# Altium schematic sheet SW7201.SchDoc
size 381 x 406 mm; SheetNumber: 1; SheetTotal: 1
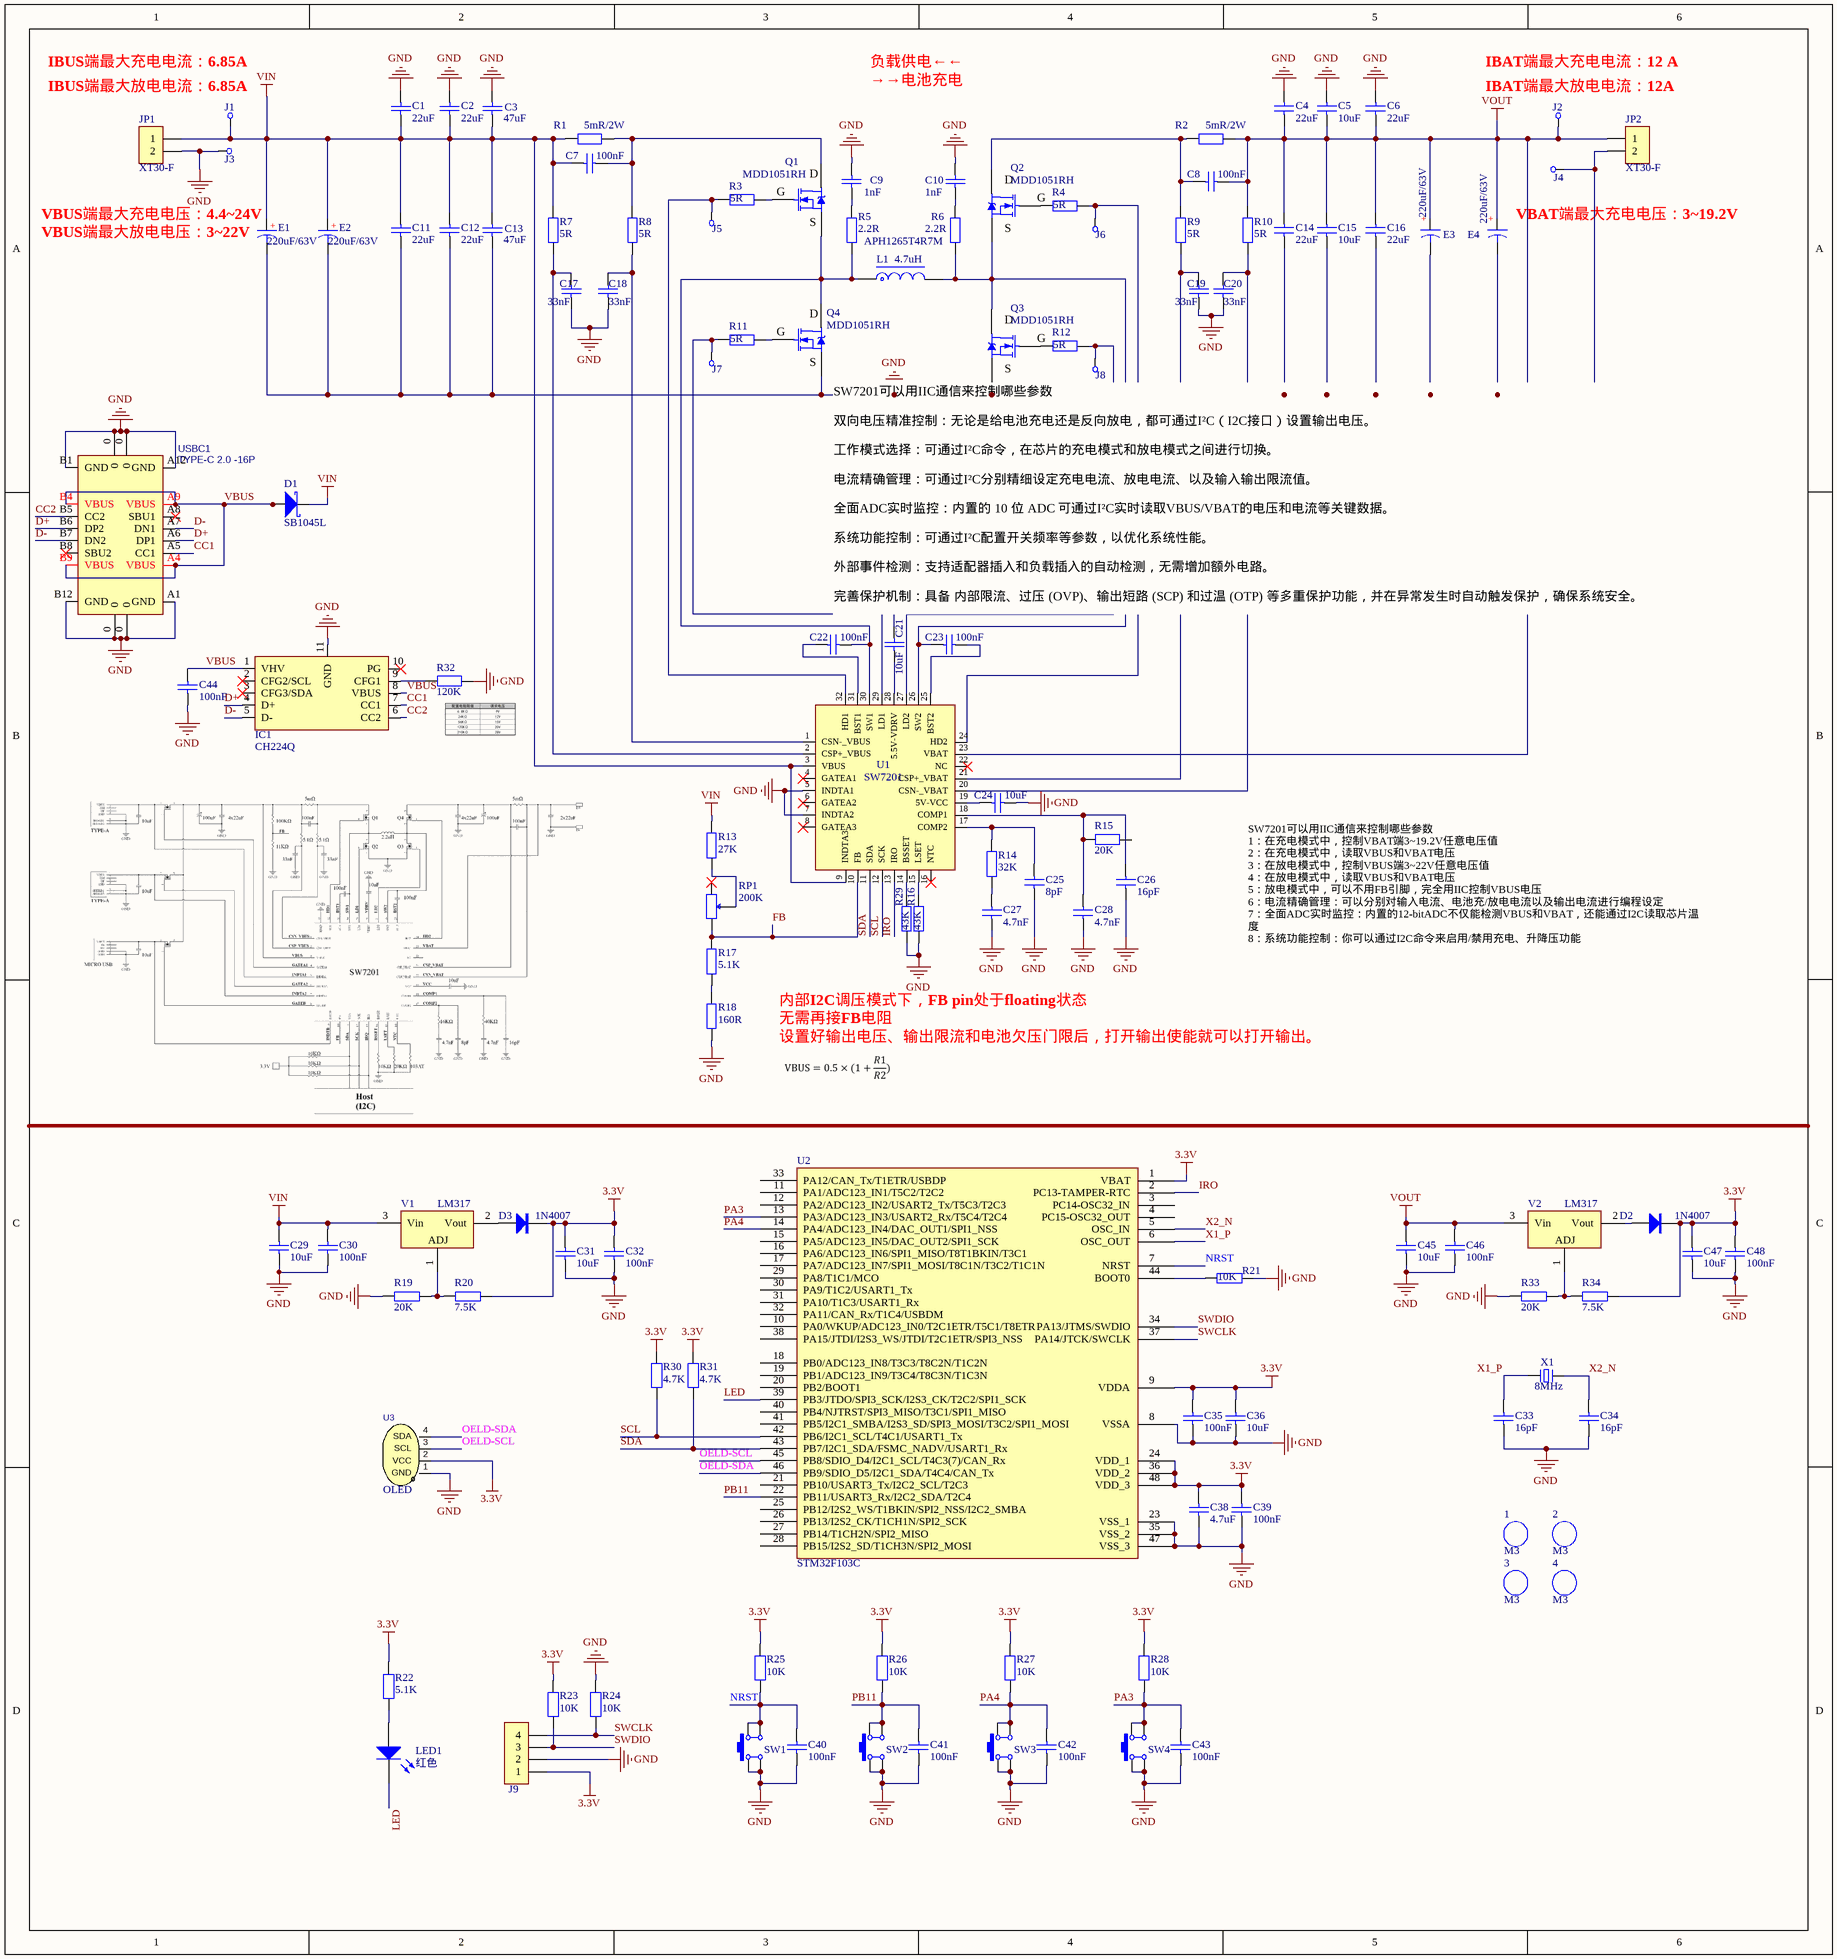
[diagram p0: SW7201.SchDoc]

## Parts
1  M3  [M3 125X200]
2  M3  [M3 125X200]
3  M3  [M3 125X200]
4  M3  [M3 125X200]
C1  22uF  [C0805_L]
C2  22uF  [C0805_L]
C3  47uF  [C0805_L]
C4  22uF  [C0805_L]
C5  10uF  [C0805_L]
C6  22uF  [C0805_L]
C7  100nF  [C0805_L]
C8  100nF  [C0805_L]
C9  1nF  [C0805_L]
C10  1nF  [C0805_L]
C11  22uF  [C0805_L]
C12  22uF  [C0805_L]
C13  47uF  [C0805_L]
C14  22uF  [C0805_L]
C15  10uF  [C0805_L]
C16  22uF  [C0805_L]
C17  33nF  [C0805_L]
C18  33nF  [C0805_L]
C19  33nF  [C0805_L]
C20  33nF  [C0805_L]
C21  10uF  [C0805_L]
C22  100nF  [C0805_L]
C23  100nF  [C0805_L]
C24  10uF  [C0805_L]
C25  8pF  [C0805_L]
C26  16pF  [C0805_L]
C27  4.7nF  [C0805_L]
C28  4.7nF  [C0805_L]
C29  10uF  [C0805_L]
C30  100nF  [C0805_L]
C31  10uF  [C0805_L]
C32  100nF  [C0805_L]
C33  16pF  [C0805_L]
C34  16pF  [C0805_L]
C35  100nF  [C0805_L]
C36  10uF  [C0805_L]
C38  4.7uF  [C0805_L]
C39  100nF  [C0805_L]
C40  100nF  [C0805_L]
C41  100nF  [C0805_L]
C42  100nF  [C0805_L]
C43  100nF  [C0805_L]
C44  100nF  [C0805_L]
C45  10uF  [C0805_L]
C46  100nF  [C0805_L]
C47  10uF  [C0805_L]
C48  100nF  [C0805_L]
D1  SB1045L  [TO-277_3P-L5.4-W4.0]
D2  1N4007  [SOD-123]
D3  1N4007  [SOD-123]
E1  220uF/63V  [CT 5.0*10*13 - R]
E2  220uF/63V  [CT 5.0*10*13 - R]
E3  220uF/63V  [CT 5.0*10*13 - R]
E4  220uF/63V  [CT 5.0*10*13 - R]
IC1  CH224Q  [DFN-10_L2.0-W2]
J1  CHECK  [CHECK-A]  (value not drawn)
J2  CHECK  [CHECK-A]  (value not drawn)
J3  CHECK  [CHECK-A]  (value not drawn)
J4  CHECK  [CHECK-A]  (value not drawn)
J5  CHECK  [CHECK-A]  (value not drawn)
J6  CHECK  [CHECK-A]  (value not drawn)
J7  CHECK  [CHECK-A]  (value not drawn)
J8  CHECK  [CHECK-A]  (value not drawn)
J9  HDR-1X4  [HDR2.54-LI-4P]  (value not drawn)
JP1  XT30-F  [XT30PW-F]
JP2  XT30-F  [XT30PW-F]
L1  4.7uH  [SMD,13.5x12.6mm]
LED1  红色  [LED0805_G]
Q1  MDD1051RH  [TO252]
Q2  MDD1051RH  [TO252]
Q3  MDD1051RH  [TO252]
Q4  MDD1051RH  [TO252]
R1  5mR/2W  [R2512_M]
R2  5mR/2W  [R2512_M]
R3  5R  [R0805_L]
R4  5R  [R0805_L]
R5  2.2R  [R0805_L]
R6  2.2R  [R0805_L]
R7  5R  [R0805_L]
R8  5R  [R0805_L]
R9  5R  [R0805_L]
R10  5R  [R0805_L]
R11  5R  [R0805_L]
R12  5R  [R0805_L]
R13  27K  [R0805_L]
R14  32K  [R0805_L]
R15  20K  [R0805_L]
R16  43K  [R0805_L]
R17  5.1K  [R0805_L]
R18  160R  [R0805_L]
R19  20K  [R0805_L]
R20  7.5K  [R0805_L]
R21  10K  [R0805_L]
R22  5.1K  [R0805_L]
R23  10K  [R0805_L]
R24  10K  [R0805_L]
R25  10K  [R0805_L]
R26  10K  [R0805_L]
R27  10K  [R0805_L]
R28  10K  [R0805_L]
R29  43K  [R0805_L]
R30  4.7K  [R0805_L]
R31  4.7K  [R0805_L]
R32  120K  [R0805_L]
R33  20K  [R0805_L]
R34  7.5K  [R0805_L]
RP1  200K  [3296W]
SW1  4.5x4.5x3.8  [SW SMD-4.5*4.5*3.8]  (value not drawn)
SW2  4.5x4.5x3.8  [SW SMD-4.5*4.5*3.8]  (value not drawn)
SW3  4.5x4.5x3.8  [SW SMD-4.5*4.5*3.8]  (value not drawn)
SW4  4.5x4.5x3.8  [SW SMD-4.5*4.5*3.8]  (value not drawn)
U1  SW7201  [QFN32_L4.0-W4.0-P0.4]
U2  STM32F103C  [LQFP-48_M]
U3  OLED  [OLED]
USBC1  TYPE-C 2.0 -16P  [USB-C-SMD_16P]
V1  LM317  [SOT223_M]
V2  LM317  [SOT223_M]
X1  8MHz  [XTAL-5032-2P]

## Nets
3.3V: C31.2 C32.2 C35.2 C36.2 C38.2 C39.2 C47.2 C48.2 D2.2(K) D3.2(K) J9.1 R20.2 R22.1 R23.1 R25.1 R26.1 R27.1 R28.1 R30.1 R31.1 R34.2 U2.1(VBAT) U2.9(VDDA) U2.24(VDD_1) U2.36(VDD_2) U2.48(VDD_3) U3.2(VCC)
GND: C1.2 C2.2 C3.2 C4.2 C5.2 C6.2 C9.1 C10.1 C11.1 C12.1 C13.1 C14.1 C15.1 C16.1 C17.2 C18.2 C19.2 C20.2 C21.2 C24.1 C25.1 C26.1 C27.1 C28.1 C29.1 C30.1 C31.1 C32.1 C33.1 C34.1 C35.1 C36.1 C38.1 C39.1 C40.1 C41.1 C42.1 C43.1 C44.1 C45.1 C46.1 C47.1 C48.1 E1.2 E2.2 E3.2 E4.2 IC1.11(GND) J3.1 J4.1 J9.2 JP1.2 JP2.2 Q3.3(S) Q4.3(S) R16.1 R18.2 R19.1 R21.2 R24.1 R29.1 R32.2 R33.1 SW1.1 SW1.4 SW2.1 SW2.4 SW3.1 SW3.4 SW4.1 SW4.4 U1.5(INDTA1) U1.7(INDTA2) U2.8(VSSA) U2.23(VSS_1) U2.35(VSS_2) U2.47(VSS_3) U3.1(GND) USBC1.0 USBC1.A1(GND) USBC1.A12(GND) USBC1.B1(GND) USBC1.B12(GND)
VIN: C1.1 C2.1 C3.1 C7.2 C11.2 C12.2 C13.2 C29.2 C30.2 D1.2(K) E1.1 E2.1 J1.1 JP1.1 R1.2 R7.2 R13.1 U1.3(VBUS) U1.9(INDTA3) V1.3(Vin)
VOUT: C4.1 C5.1 C6.1 C8.1 C14.2 C15.2 C16.2 C45.2 C46.2 E3.1 E4.1 J2.1 JP2.1 R2.1 R10.2 U1.23(VBAT) V2.3(Vin)
CC1: IC1.7(CC1) USBC1.A5(CC1)
CC2: IC1.6(CC2) USBC1.B5(CC2)
D+: IC1.4(D+) USBC1.A6(DP1) USBC1.B6(DP2)
D-: IC1.5(D-) USBC1.A7(DN1) USBC1.B7(DN2)
FB: R17.1 RP1.1 U1.10(FB)
IRO: U1.13(IRO) U2.2(PC13-TAMPER-RTC)
LED: LED1.2(K) U2.39(PB3/JTDO/SPI3_SCK/I2S3_CK/T2C2/SPI1_SCK)
NRST: C40.2 R25.2 SW1.2 SW1.3 U2.7(NRST)
OELD-SCL: U2.45(PB8/SDIO_D4/I2C1_SCL/T4C3(7)/CAN_Rx) U3.3(SCL)
OELD-SDA: U2.46(PB9/SDIO_D5/I2C1_SDA/T4C4/CAN_Tx) U3.4(SDA)
PA3: C43.2 R28.2 SW4.2 SW4.3 U2.13(PA3/ADC123_IN3/USART2_Rx/T5C4/T2C4)
PA4: C42.2 R27.2 SW3.2 SW3.3 U2.14(PA4/ADC123_IN4/DAC_OUT1/SPI1_NSS)
PB11: C41.2 R26.2 SW2.2 SW2.3 U2.22(PB11/USART3_Rx/I2C2_SDA/T2C4)
SCL: R30.2 U1.12(SCK) U2.42(PB6/I2C1_SCL/T4C1/USART1_Tx)
SDA: R31.2 U1.11(SDA) U2.43(PB7/I2C1_SDA/FSMC_NADV/USART1_Rx)
SWCLK: J9.4 R24.2 U2.37(PA14/JTCK/SWCLK)
SWDIO: J9.3 R23.2 U2.34(PA13/JTMS/SWDIO)
VBUS: C44.2 D1.1(A) D1.3(A) IC1.1(VHV) IC1.8(VBUS) USBC1.A4(VBUS) USBC1.A9(VBUS) USBC1.B4(VBUS) USBC1.B9(VBUS)
X1_P: C33.2 U2.6(OSC_OUT) X1.1
X2_N: C34.2 U2.5(OSC_IN) X1.2
NetC7_1: C7.1 Q1.2(D) R1.1 R8.2
NetC8_2: C8.2 Q2.2(D) R2.2 R9.2
NetC9_2: C9.2 R5.1
NetC10_2: C10.2 R6.1
NetC17_1: C17.1 R7.1 U1.2(CSP+_VBUS)
NetC18_1: C18.1 R8.1 U1.1(CSN-_VBUS)
NetC19_1: C19.1 R9.1 U1.21(CSP+_VBAT)
NetC20_1: C20.1 R10.1 U1.20(CSN-_VBAT)
NetC21_1: C21.1 U1.28(5.5V-VDRV)
NetC22_1: C22.1 L1.1 Q1.3(S) Q4.2(D) R5.2 U1.30(SW1)
NetC22_2: C22.2 U1.31(BST1)
NetC23_1: C23.1 U1.25(BST2)
NetC23_2: C23.2 L1.2 Q2.3(S) Q3.2(D) R6.2 U1.26(SW2)
NetC24_2: C24.2 U1.19(5V-VCC)
NetC25_2: C25.2 R14.1 U1.17(COMP2)
NetC26_2: C26.2 C28.2 R15.1 U1.18(COMP1)
NetC27_2: C27.2 R14.2
NetD2_1: D2.1(A) V2.2(Vout)
NetD3_1: D3.1(A) V1.2(Vout)
NetIC1_9: IC1.9(CFG1) R32.1
NetJ5_1: J5.1 R3.2 U1.32(HD1)
NetJ6_1: J6.1 R4.1 U1.24(HD2)
NetJ7_1: J7.1 R11.2 U1.29(LD1)
NetJ8_1: J8.1 R12.1 U1.27(LD2)
NetLED1_1: LED1.1(A) R22.2
NetQ1_1: Q1.1(G) R3.1
NetQ2_1: Q2.1(G) R4.2
NetQ3_1: Q3.1(G) R12.2
NetQ4_1: Q4.1(G) R11.1
NetR13_2: R13.2 RP1.2
NetR16_2: R16.2 U1.15(LSET)
NetR17_2: R17.2 R18.1
NetR19_2: R19.2 R20.1 V1.1(ADJ)
NetR21_1: R21.1 U2.44(BOOT0)
NetR29_2: R29.2 U1.14(BSSET)
NetR33_2: R33.2 R34.1 V2.1(ADJ)

Not connected (* = marked no-connect by the designer): IC1 2(CFG2/SCL)* 3(CFG3/SDA)* 10(PG)*; R15 2; RP1 3*; U1 4(GATEA1)* 6(GATEA2)* 8(GATEA3)* 16(NTC)* 22(NC)*; U2 3(PC14-OSC32_IN) 4(PC15-OSC32_OUT) 10(PA0/WKUP/ADC123_IN0/T2C1ETR/T5C1/T8ETR) 11(PA1/ADC123_IN1/T5C2/T2C2) 12(PA2/ADC123_IN2/USART2_Tx/T5C3/T2C3) 15(PA5/ADC123_IN5/DAC_OUT2/SPI1_SCK) 16(PA6/ADC123_IN6/SPI1_MISO/T8T1BKIN/T3C1) 17(PA7/ADC123_IN7/SPI1_MOSI/T8C1N/T3C2/T1C1N) 18(PB0/ADC123_IN8/T3C3/T8C2N/T1C2N) 19(PB1/ADC123_IN9/T3C4/T8C3N/T1C3N) 20(PB2/BOOT1) 21(PB10/USART3_Tx/I2C2_SCL/T2C3) 25(PB12/I2S2_WS/T1BKIN/SPI2_NSS/I2C2_SMBA) 26(PB13/I2S2_CK/T1CH1N/SPI2_SCK) 27(PB14/T1CH2N/SPI2_MISO) 28(PB15/I2S2_SD/T1CH3N/SPI2_MOSI) 29(PA8/T1C1/MCO) 30(PA9/T1C2/USART1_Tx) 31(PA10/T1C3/USART1_Rx) 32(PA11/CAN_Rx/T1C4/USBDM) 33(PA12/CAN_Tx/T1ETR/USBDP) 38(PA15/JTDI/I2S3_WS/JTDI/T2C1ETR/SPI3_NSS) 40(PB4/NJTRST/SPI3_MISO/T3C1/SPI1_MISO) 41(PB5/I2C1_SMBA/I2S3_SD/SPI3_MOSI/T3C2/SPI1_MOSI); USBC1 A8(SBU1)* B8(SBU2)*

## Notes on the sheet
- IBUS端最大充电电流：6.85A
- →→电池充电
- 负载供电←←
- IBAT端最大充电电流：12 A
- IBUS端最大放电电流：6.85A
- (near J2) IBAT端最大放电电流：12A
- VBUS端最大充电电压：4.4~24V
- VBUS端最大放电电压：3~22V
- (near R5) APH1265T4R7M
- (near E4) VBAT端最大充电电压：3~19.2V
- SW7201可以用IIC通信来控制哪些参数
  双向电压精准控制：无论是给电池充电还是反向放电，都可通过I²C（I2C接口）设置输出电压。
  工作模式选择：可通过I²C命令，在芯片的充电模式和放电模式之间进行切换。
  电流精确管理：可通过I²C分别精细设定充电电流、放电电流、以及输入输出限流值。
  全面ADC实时监控：内置的 10 位 ADC 可通过I²C实时读取VBUS/VBAT的电压和电流等关键数据。
  系统功能控制：可通过I²C配置开关频率等参数，以优化系统性能。
  外部事件检测：支持适配器插入和负载插入的自动检测，无需增加额外电路。
  完善保护机制：具备 内部限流、过压 (OVP)、输出短路 (SCP) 和过温 (OTP) 等多重保护功能，并在异常发生时自动触发保护，确保系统安全。
- 内部I2C调压模式下，FB pin处于floating状态
- SW7201可以用IIC通信来控制哪些参数
  1：在充电模式中，控制VBAT端3~19.2V任意电压值
  2：在充电模式中，读取VBUS和VBAT电压
  3：在放电模式中，控制VBUS端3~22V任意电压值
  4：在放电模式中，读取VBUS和VBAT电压
  5：放电模式中，可以不用FB引脚，完全用IIC控制VBUS电压
  6：电流精确管理：可以分别对输入电流、电池充/放电电流以及输出电流进行编程设定
  7：全面ADC实时监控：内置的12-bitADC不仅能检测VBUS和VBAT，还能通过I2C读取芯片温度
  8：系统功能控制：你可以通过I2C命令来启用/禁用充电、升降压功能
- 无需再接FB电阻
- 设置好输出电压、输出限流和电池欠压门限后，打开输出使能就可以打开输出。
- (in symbol CS) +

## Library data of the parts
1-4 = M3: 铜柱孔; 联系下单店铺卖家 免费技术支持: 联系下单店铺卖家 免费帮你查找封装; BOM名称: 铜柱孔
C1-C36 C38-C48 = C: 贴片电容/MLCC电容; BOM名称: 无极性贴片电容; 联系下单店铺卖家 免费帮你查找封装: 联系下单店铺卖家 免费技术指导
D2 D3 = 1N4007: 整流二极管; 当前库版本V2025.1.5，下一版本发布时间2025年2月份 @淘宝卖家:黄晶宝石: 最新版本发布网址https://item.taobao.com/item.htm?id=566775463719; BOM名称: 整流二极管
E1-E4 = CS: 直插固态电容; 联系下单店铺卖家 免费帮你查找封装: 联系下单店铺卖家 免费技术指导; 当前库版本V2025.1.5，下一版本发布时间2025年2月份 @淘宝卖家:黄晶宝石: 最新版本发布网址https://item.taobao.com/item.htm?id=566775463719; BOM名称: 直插固态电容
J1-J8 = CHECK: 测试点
J9 = Header 4: 4P接插件; 联系卖家，免费查找封装: 唯一出售店铺网址https://shop463601444.taobao.com; 封装库来自淘宝卖家ID：黄晶宝石: 其他店铺购入均为盗版封装库，请立即申请退款，本店现金奖励50~200元; BOM名称: 4P接插件
JP1 JP2 = XT30-F: XT30母座; 当前库版本V2025.1.5，下一版本发布时间2025年2月份 @淘宝卖家:黄晶宝石: 最新版本发布网址https://item.taobao.com/item.htm?id=566775463719
L1 = L-Molding Choke: 一体成型电感; 联系下单店铺卖家 免费帮你查找封装: 联系下单店铺卖家 免费技术指导; BOM名称: 一体成型电感
LED1 = LED: 贴片LED; 封装库来自淘宝卖家：黄晶宝石: 其他店铺购入均为盗版封装库，无更新权益，请立即申请退款，本店现金奖励200~1000元; BOM名称: 贴片LED
Q1-Q4 = NCE3080: N沟道 30V/80A; BOM名称: N沟场效应管; 联系下单店铺卖家 免费帮你查找封装: 联系下单店铺卖家 免费技术支持; 当前库版本V2025.1.5，下一版本发布时间2025年2月份 @淘宝卖家:黄晶宝石: 最新版本发布网址https://item.taobao.com/item.htm?id=566775463719
R1-R34 = R: 贴片电阻; 联系下单店铺卖家 免费帮你查找封装: 联系下单店铺卖家 免费技术指导; BOM名称: 贴片电阻
RP1 = RP: 单联电位器; BOM名称: 插件电位器; 联系下单店铺卖家 免费帮你查找封装: 联系下单店铺卖家 免费技术指导
SW1-SW4 = SW SMD-4.5x4.5: 贴片4.5x4.5轻触开关; BOM名称: 贴片4x4轻触开关; 联系下单店铺卖家 免费技术支持: 联系下单店铺卖家 免费帮你查找封装
U1 = SW7201: 3~35V支持I2C控制的高效率双向升降压充放电控制器
U2 = STM32F103C: STM32单片机48引脚
U3 = OLED: 0.96OLED; Symbol: HS96L03W2C03
USBC1 = USB2.0_Type-C_16Pin: USB2.0_Type-C_16Pin母座; 当前库版本V2025.1.5，下一版本发布时间2025年2月份 @淘宝卖家:黄晶宝石: 最新版本发布网址https://item.taobao.com/item.htm?id=566775463719
V1 V2 = LM317: 可调线性稳压芯片; 当前库版本V2025.1.5，下一版本发布时间2025年2月份 @淘宝卖家:黄晶宝石: 最新版本发布网址https://item.taobao.com/item.htm?id=566775463719; BOM名称: 可调线性稳压芯片
X1 = XTAL-2P: 2脚无源晶振(谐振器）; 联系下单店铺卖家 免费帮你查找封装: 联系下单店铺卖家 免费技术指导; BOM名称: 2脚无源晶振(谐振器）